# EAGLE design power_control_subsystem (EAGLE 5.11)
DIGIKEY: 553-1558-5-ND
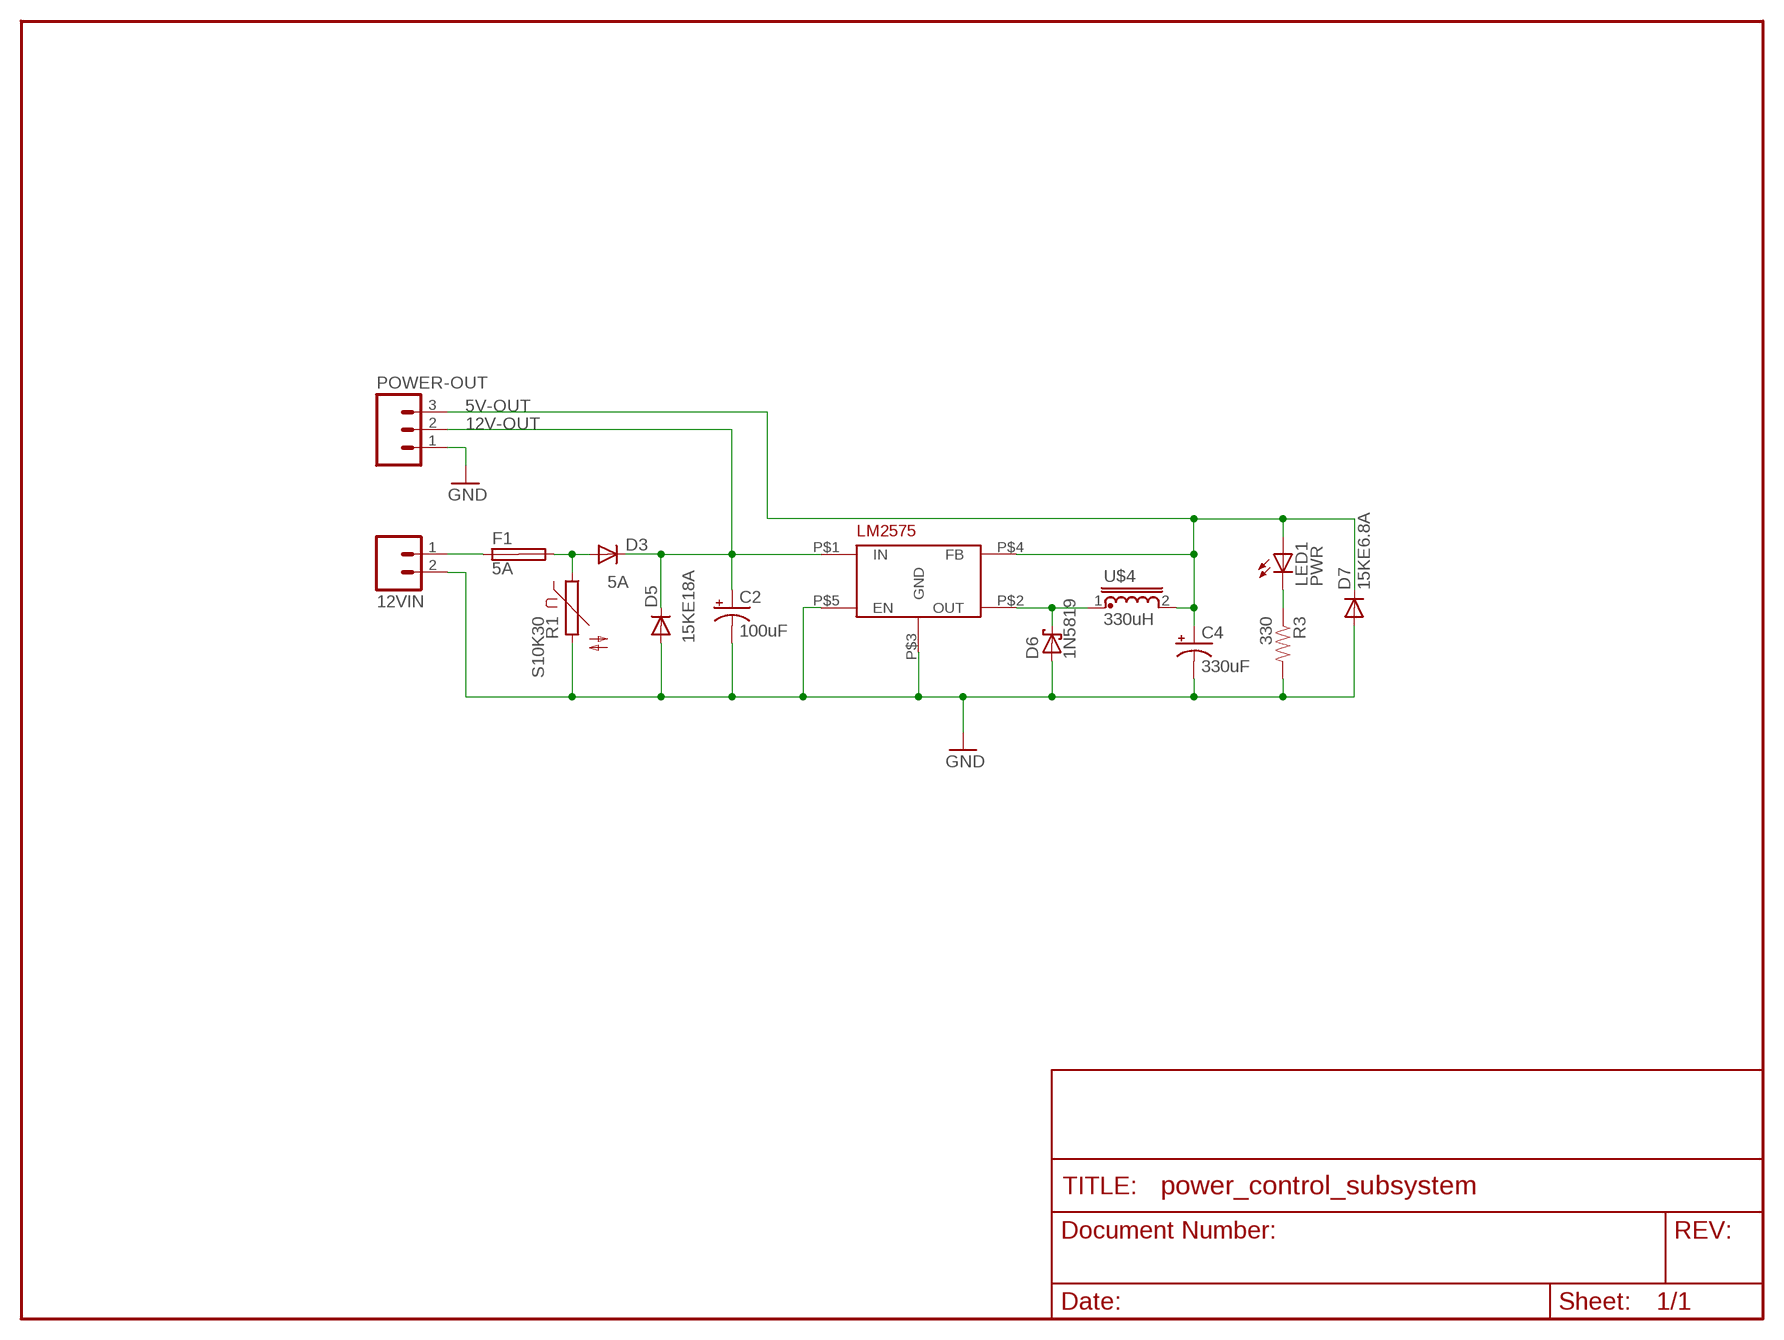
[diagram p0: schematic, sheet 1]

## Parts
12VIN  M023.5MM  [SCREWTERMINAL-3.5MM-2]
C2  100uF  CPOL-USE3.5-8  [E3,5-8]
C4  330uF  CPOL-USE3.5-8  [E3,5-8]
D3  5A  DIODE-P6-15  [P6-15]
D5  15KE18A  [DO201-15]
D6  1N5819  1N5819-B  [DO41-7.6]
D7  15KE6.8A  15KE18A  [DO201-15]
F1  5A  5X20MMCLIP  [SHK20Q]
LED1  PWR  LED5MM  [LED5MM]
POWER-OUT  M03SCREW  [SCREWTERMINAL-3.5MM-3]
R1  S10K30  [S10K]
R3  330  RESISTORPTH-1/4W  [AXIAL-0.4]
U$3  LM2575  [TO220-5PIN-1]
U$4  330uH  PE-52647NLPE-52647NL  [PE-52647-NL]

## Nets
5V-OUT: C4.+ D7.C LED1.A POWER-OUT.3 U$3.P$4(FB) U$4.2
12V-OUT [signal]: C2.+ D3.C D5.C POWER-OUT.2 U$3.P$1(IN)
GND: 12VIN.2 C2.- C4.- D5.A D6.A D7.A POWER-OUT.1 R1.2 R3.P$2 U$3.P$3(GND) U$3.P$5(EN)
N$1: 12VIN.1 F1.1A
N$3: D3.A F1.2A R1.1
N$6: D6.C U$3.P$2(OUT) U$4.1
N$11: LED1.K(C) R3.P$1
Unconnected: F1.1B F1.2B

## Library data of the parts
12VIN = SparkFun:M02: Header 2 Standard 2-pin 0.1" header. Use with straight break away headers (SKU : PRT-00116), right angle break away headers (PRT-00553), swiss pins (PRT-00743), machine pins (PRT-00117), and female headers (PRT-00115). Molex polarized connector foot print use with SKU : PRT-08233 with associated crimp pins and housings.
C2 C4 = adafruit:CPOL-US: POLARIZED CAPACITOR, American symbol
D3 = diode:DIODE-: DIODE
D5 D7 = 23B_Shop_Library:15KE18A: TVS Diode 15V TVS Protection Diode
D6 = diode:1N581*: 1.0A SCHOTTKY BARRIER RECTIFIER Source: http://www.diodes.com/datasheets/ds23001.pdf
F1 = 23B_Shop_Library:5X20MMCLIP: FUSE HOLDER Littelfuse 01110506H 5x20mm clips. Mouser part #576-01110506H
LED1 = SparkFun:LED: LEDs Standard schematic elements and footprints for 5mm, 3mm, 1206, and 0603 sized LEDs. 5mm - Spark Fun Electronics SKU : COM-00529 (and others)
POWER-OUT = SparkFun:M03: Header 3 Standard 3-pin 0.1" header. Use with straight break away headers (SKU : PRT-00116), right angle break away headers (PRT-00553), swiss pins (PRT-00743), machine pins (PRT-00117), and female headers (PRT-00115). Molex polarized connector foot print use with SKU : PRT-08232 with associated crimp pins and housings.
R1 = 23B_Shop_Library:S10K30: VARISTOR - 30V, 10mm package
R3 = SparkFun:RESISTOR: Resistor Basic schematic elements and footprints for 0603, 1206, and PTH resistors.
U$3 = 23B_Shop_Library:LM2575: Fixed 5V Simple Switcher from National, staggered pins
U$4 = 23B_Shop_Library:PE-52647NL: 330uH, 1A Inductor from Pulse Engineering. Used with National Semiconductor Simple Switcher.

## Net classes
2 signal: width 0.406 mm, clearance 0.305 mm

## Board
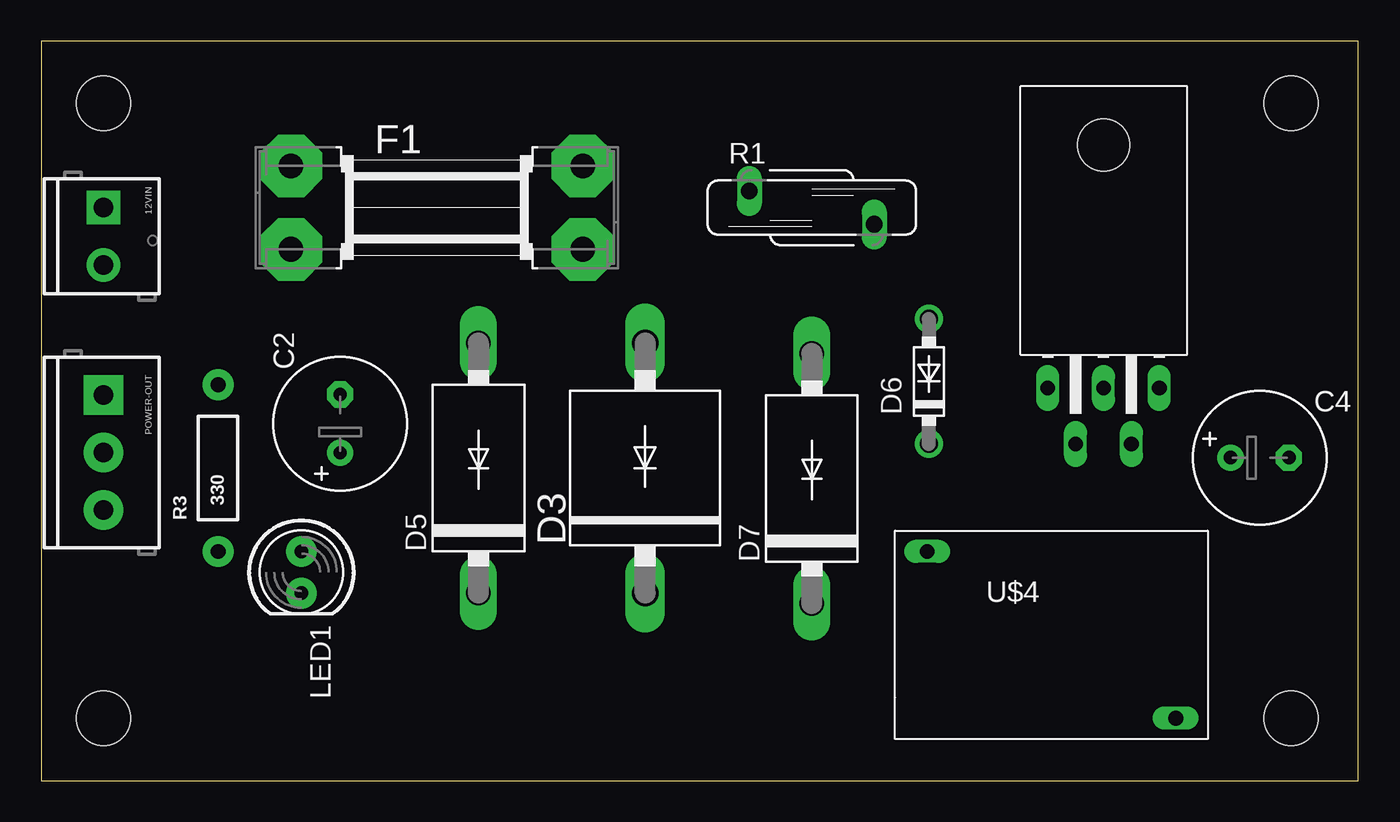
[diagram p1: board, top side]
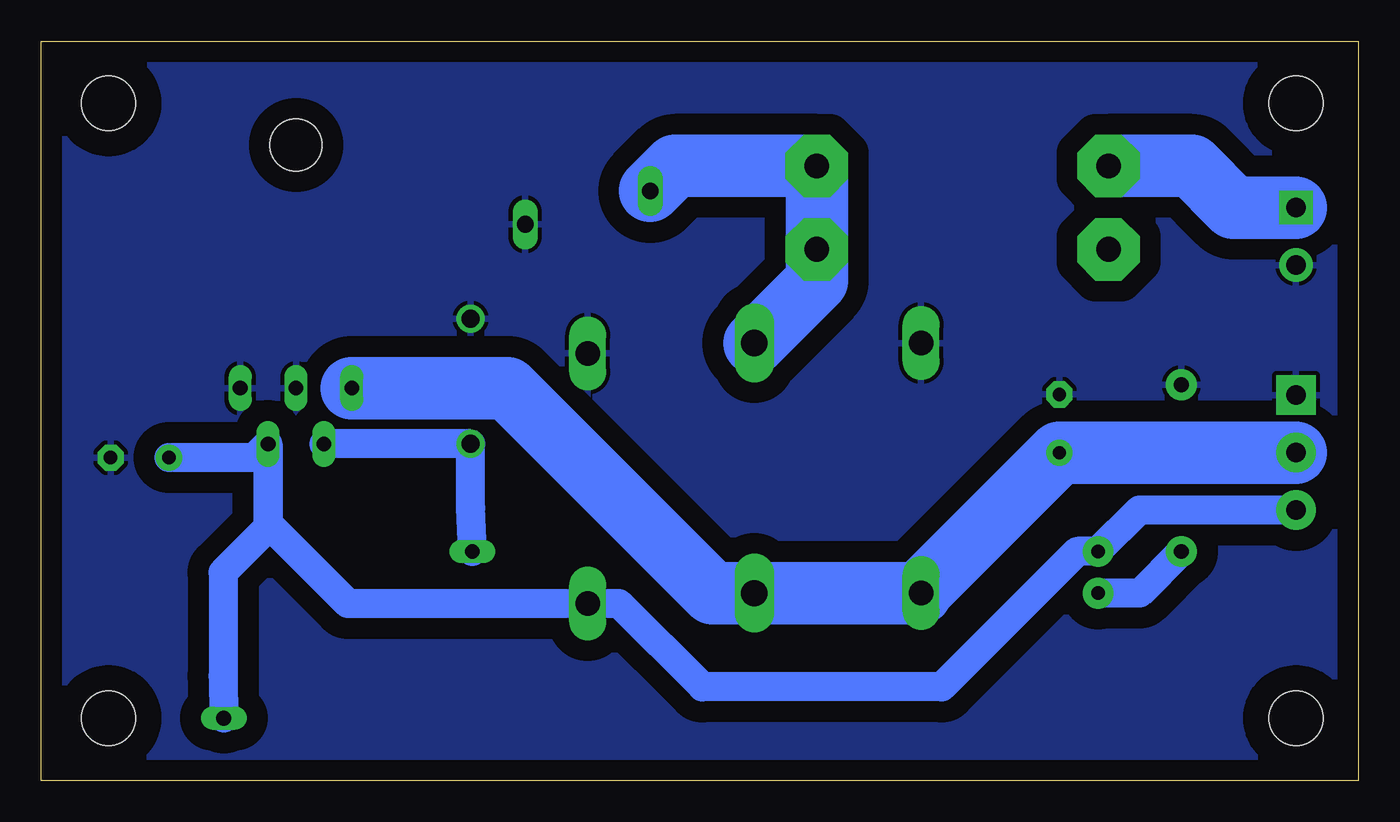
[diagram p2: board, bottom side, seen from below]

Size 80.31 x 45.07 mm. Coordinates in mm from the lower left corner, seen from the top.
Outline: 0,0 80.31,0 80.31,45.07 0,45.07 0,0
Copper layers (1*16): Top 0.035mm / dielectric 1.5mm / Bottom 0.035mm
Design rules "default": minimum track width 10mil, minimum drill 24mil, track to track 8mil, track to pad 8mil, pad to pad 8mil, via to via 8mil, smd to smd 8mil, copper to edge 40mil, drill to drill 8mil, minimum pad ring 10mil, minimum via ring 8mil, stop-mask expansion 4mil, vias tented up to drill 0mil, thermal gap 10mil

### Footprints (pad centres in the part's own frame; a part is rotated, then mirrored left to right if it is on the bottom)
SCREWTERMINAL-3.5MM-2 = drill 1.2 pad 2.032 square: 1 0,0 | drill 1.2 pad 2.032 round: 2 3.5,0
E3,5-8 = drill 0.813 pad 1.6 round: + -1.778,0 | drill 0.813 pad 1.6 octagon: - 1.778,0
P6-15 = drill 1.6 long: A 7.62,0; C -7.62,0
DO201-15 = drill 1.499 long: A 7.62,0; C -7.62,0
DO41-7.6 = drill 1.1 pad 1.7 round: A 3.81,0; C -3.81,0
SHK20Q = drill 1.5 pad 3.81 octagon: 1A -8.89,2.54; 1B -8.89,-2.54; 2A 8.89,2.54; 2B 8.89,-2.54
LED5MM = drill 0.813 pad 1.88 round: A -1.27,0; K 1.27,0
SCREWTERMINAL-3.5MM-3 = drill 1.2 pad 2.413 square: 1 0,0 | drill 1.2 pad 2.413 round: 2 3.5,0; 3 7,0
S10K = drill 1.016 long: 1 -1.016,-3.81; 2 1.016,3.81
AXIAL-0.4 = drill 0.9 pad 1.88 round: P$1 -5.08,0; P$2 5.08,0
STAND-OFF = hole 3.302: 0,0
TO220-5PIN-1 = drill 0.9 long: P$1 -3.4,1.7; P$2 -1.7,-1.7; P$3 0,1.7; P$4 1.7,-1.7; P$5 3.4,1.7 | hole 3.175: 0,16.51
PE-52647-NL = drill 0.9 long: 1 -7.58,6.35; 2 7.58,-3.81

### Placement (x,y rotation side)
12VIN  3.81,34.92 270 top
C2  18.24,21.76 90 top
C4  74.3,19.68 0 top
D3  36.83,19.05 90 top
D5  26.67,19.05 90 top
D6  54.13,24.33 90 top
D7  46.99,18.41 90 top
F1  24.13,34.92 0 top
LED1  15.88,12.7 270 top
POWER-OUT  3.81,23.49 270 top
R1  46.99,34.92 270 top
R3  10.79,19.05 90 top
U$1  [STAND-OFF]  3.81,41.27 0 top
U$2  [STAND-OFF]  3.81,3.81 0 top
U$3  64.77,22.22 0 top
U$4  61.59,7.62 0 top
U$5  [STAND-OFF]  76.2,3.81 0 top
U$6  [STAND-OFF]  76.2,41.27 0 top

### Tracks (layer width: path | path; a pad name or v marks a point on that pad's centre or on a via)
5V-OUT
  Bottom 1.778: U$3.P$4 66.47,15.45 69.21,12.7 69.21,6.39 U$4.2 | U$3.P$4 66.47,15.67 61.59,10.79 D7.C 45.09,10.79 40.01,5.71 25.4,5.71 17.14,13.97 LED1.A 13.35,16.49 POWER-OUT.3 | C4.+ 67.31,19.68 U$3.P$4
12V-OUT
  Bottom 3.81: U$3.P$1 51.87,23.92 39.37,11.43 D3.C D5.C 26.67,11.55 C2.+ 3.82,19.98 POWER-OUT.2
GND
  pour Bottom (isolate 1.27): 0,0 0,45.09 80.64,45.09 80.01,0
N$1
  Bottom 3.81: 12VIN.1 7.62,34.92 10.16,37.46 F1.1A
N$3
  Bottom 3.81: R1.1 41.66,37.46 F1.2A 33.02,30.48 D3.A
N$6
  Bottom 1.778: U$3.P$2 D6.C 54.13,16.62 U$4.1
N$11
  Bottom 1.778: LED1.K 13.34,11.43 R3.P$1